# Altium schematic sheet encoder.SchDoc
size A3
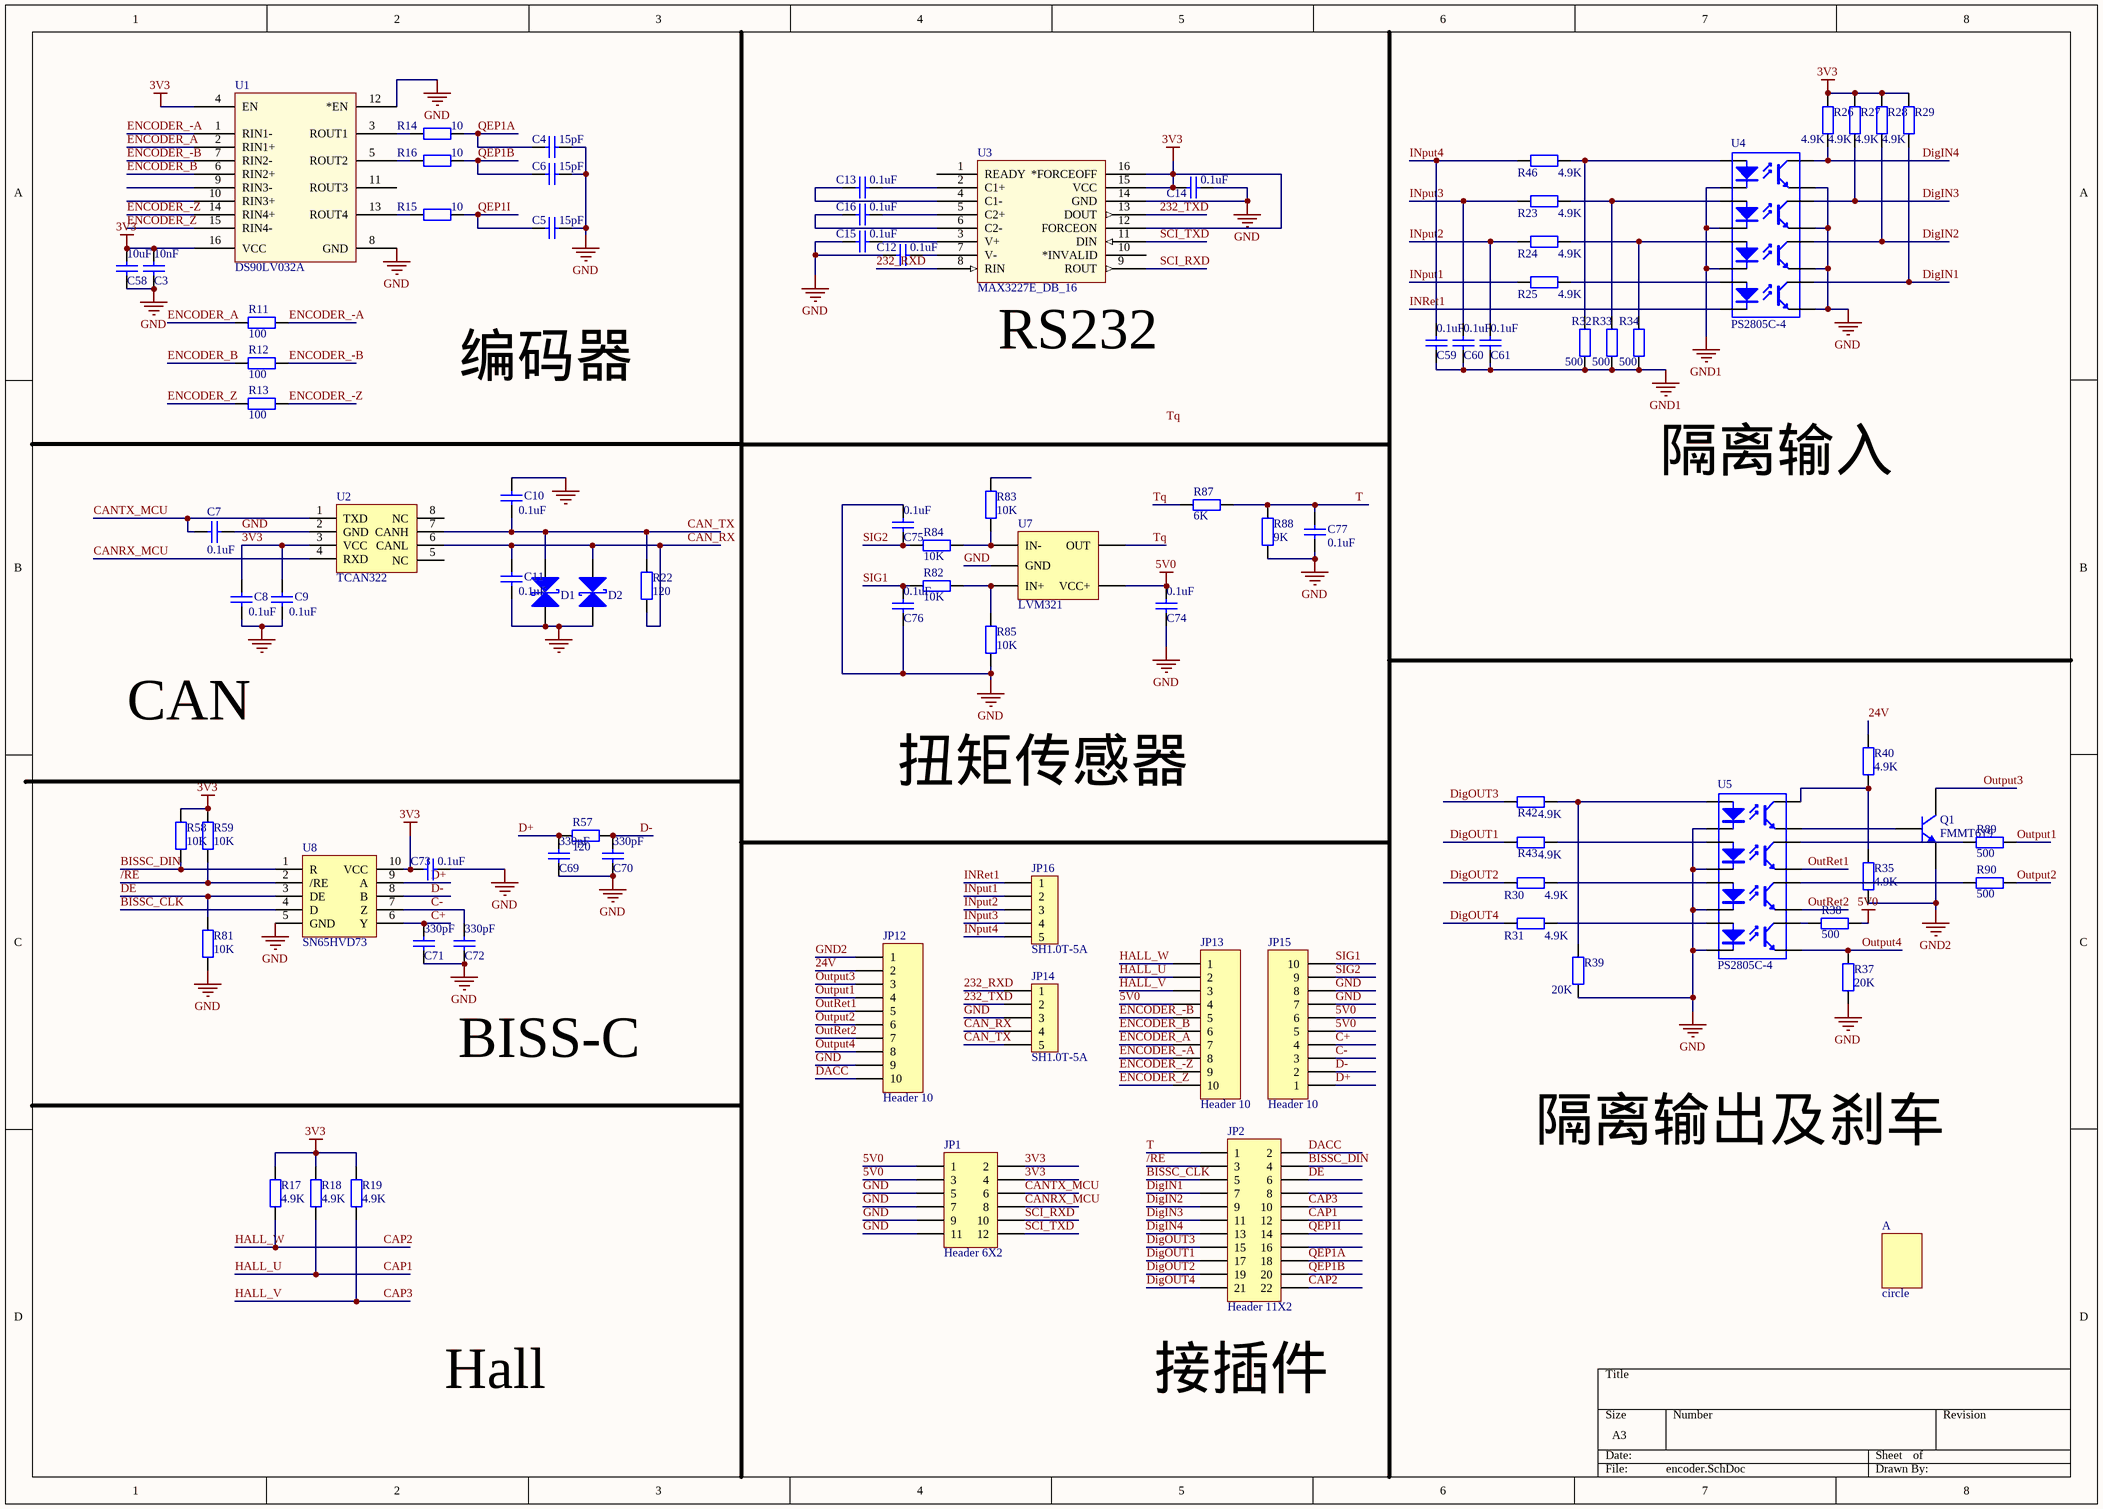
[diagram p0: encoder.SchDoc]

## Parts
A  circle  [Circle]
C3  value 10nF  [CC1608-0603]  (hidden comment: 0603B103J6R3NT)
C4  value 15pF  [CC1608-0603]  (hidden comment: 0603B150J6R3NT)
C5  value 15pF  [CC1608-0603]  (hidden comment: 0603B150J6R3NT)
C6  value 15pF  [CC1608-0603]  (hidden comment: 0603B150J6R3NT)
C7  value 0.1uF  [CC1608-0603]  (hidden comment: 0603B104J6R3NT)
C8  value 0.1uF  [CC1608-0603]  (hidden comment: 0603B104J6R3NT)
C9  value 0.1uF  [CC1608-0603]  (hidden comment: 0603B104J6R3NT)
C10  value 0.1uF  [CC1608-0603]  (hidden comment: 0603B104J6R3NT)
C11  value 0.1uF  [CC1608-0603]  (hidden comment: 0603B104J6R3NT)
C12  value 0.1uF  [CC1608-0603]  (hidden comment: 0603B104J6R3NT)
C13  value 0.1uF  [CC1608-0603]  (hidden comment: 0603B104J6R3NT)
C14  value 0.1uF  [CC1608-0603]  (hidden comment: 0603B104J6R3NT)
C15  value 0.1uF  [CC1608-0603]  (hidden comment: 0603B104J6R3NT)
C16  value 0.1uF  [CC1608-0603]  (hidden comment: 0603B104J6R3NT)
C58  value 10uF  [CC2012-0805]  (hidden comment: 0805B106J100NT)
C59  value 0.1uF  [CC1608-0603]  (hidden comment: 0603B104J6R3NT)
C60  value 0.1uF  [CC1608-0603]  (hidden comment: 0603B104J6R3NT)
C61  value 0.1uF  [CC1608-0603]  (hidden comment: 0603B104J6R3NT)
C69  value 330pF  [CC1608-0603]  (hidden comment: 0603B331J6R3NT)
C70  value 330pF  [CC1608-0603]  (hidden comment: 0603B331J6R3NT)
C71  value 330pF  [CC1608-0603]  (hidden comment: 0603B331J6R3NT)
C72  value 330pF  [CC1608-0603]  (hidden comment: 0603B331J6R3NT)
C73  value 0.1uF  [CC1608-0603]  (hidden comment: 0603B104J6R3NT)
C74  value 0.1uF  [CC1608-0603]  (hidden comment: 0603B104J6R3NT)
C75  value 0.1uF  [CC1608-0603]  (hidden comment: 0603B104J6R3NT)
C76  value 0.1uF  [CC1608-0603]  (hidden comment: 0603B104J6R3NT)
C77  value 0.1uF  [CC1608-0603]  (hidden comment: 0603B104J6R3NT)
D1  Diode Schottky  [TVS]  (value not drawn)
D2  Diode Schottky  [TVS]  (value not drawn)
JP1  Header 6X2  [DC_1.27_12]
JP2  Header 11X2  [DC_1.27_22]
JP12  Header 10  [SH1.0T-10A]
JP13  Header 10  [SH1.0T-10A]
JP14  SH1.0T-5A  [SH1.0T-5A]
JP15  Header 10  [SH1.0T-10A]
JP16  SH1.0T-5A  [SH1.0T-5A]
Q1  FMMT619  [SOT-23]
R11  value 100  [CR1608-0603]  (hidden comment: RC03K101JT)
R12  value 100  [CR1608-0603]  (hidden comment: RC03K101JT)
R13  value 100  [CR1608-0603]  (hidden comment: RC03K101JT)
R14  value 10  [CR1608-0603]  (hidden comment: RC03K100JT)
R15  value 10  [CR1608-0603]  (hidden comment: RC03K100JT)
R16  value 10  [CR1608-0603]  (hidden comment: RC03K100JT)
R17  value 4.9K  [CR1608-0603]  (hidden comment: RC03K492JT)
R18  value 4.9K  [CR1608-0603]  (hidden comment: RC03K492JT)
R19  value 4.9K  [CR1608-0603]  (hidden comment: RC03K492JT)
R22  value 120  [CR1608-0603]  (hidden comment: RC03K121JT)
R23  value 4.9K  [CR1608-0603]  (hidden comment: RC03K492JT)
R24  value 4.9K  [CR1608-0603]  (hidden comment: RC03K492JT)
R25  value 4.9K  [CR1608-0603]  (hidden comment: RC03K492JT)
R26  value 4.9K  [CR1608-0603]  (hidden comment: RC03K492JT)
R27  value 4.9K  [CR1608-0603]  (hidden comment: RC03K492JT)
R28  value 4.9K  [CR1608-0603]  (hidden comment: RC03K492JT)
R29  value 4.9K  [CR1608-0603]  (hidden comment: RC03K492JT)
R30  value 4.9K  [CR1608-0603]  (hidden comment: RC03K492JT)
R31  value 4.9K  [CR1608-0603]  (hidden comment: RC03K492JT)
R32  value 500  [CR1608-0603]  (hidden comment: RC03K501JT)
R33  value 500  [CR1608-0603]  (hidden comment: RC03K501JT)
R34  value 500  [CR1608-0603]  (hidden comment: RC03K501JT)
R35  value 4.9K  [CR1608-0603]  (hidden comment: RC03K492JT)
R37  value 20K  [CR1608-0603]  (hidden comment: RC03K203JT)
R38  value 500  [CR1608-0603]  (hidden comment: RC03K501JT)
R39  value 20K  [CR1608-0603]  (hidden comment: RC03K203JT)
R40  value 4.9K  [CR1608-0603]  (hidden comment: RC03K492JT)
R42  value 4.9K  [CR1608-0603]  (hidden comment: RC03K492JT)
R43  value 4.9K  [CR1608-0603]  (hidden comment: RC03K492JT)
R46  value 4.9K  [CR1608-0603]  (hidden comment: RC03K492JT)
R57  value 120  [CR1608-0603]  (hidden comment: RC03K121JT)
R58  value 10K  [CR1608-0603]  (hidden comment: RC03K103JT)
R59  value 10K  [CR1608-0603]  (hidden comment: RC03K103JT)
R81  value 10K  [CR1608-0603]  (hidden comment: RC03K103JT)
R82  value 10K  [CR1608-0603]  (hidden comment: RC03K103JT)
R83  value 10K  [CR1608-0603]  (hidden comment: RC03K103JT)
R84  value 10K  [CR1608-0603]  (hidden comment: RC03K103JT)
R85  value 10K  [CR1608-0603]  (hidden comment: RC03K103JT)
R87  value 6K  [CR1608-0603]  (hidden comment: RC03K602JT)
R88  value 9K  [CR1608-0603]  (hidden comment: RC03K902JT)
R89  value 500  [CR1608-0603]  (hidden comment: RC03K501JT)
R90  value 500  [CR1608-0603]  (hidden comment: RC03K501JT)
U1  DS90LV032A  [DS90LV032A]
U2  TCAN322  [TCAN332]
U3  MAX3227E_DB_16  [MAX3227E]
U4  PS2805C-4  [PS2805C_4]
U5  PS2805C-4  [PS2805C_4]
U7  LVM321  [LVM321]
U8  SN65HVD73  [SN65HVD73]

## Nets
3V3: C3.2 C8.2 C9.2 C14.2 C58.2 C73.1 JP1.2 JP1.4 R17.1 R18.1 R19.1 R26.2 R27.2 R28.2 R29.2 R58.1 R59.1 U1.4(EN) U1.16(VCC) U2.3(VCC) U3.12(FORCEON) U3.15(VCC) U3.16(*FORCEOFF) U8.10(VCC)
5V0: C74.2 JP1.1 JP1.3 JP13.4 JP15.5 JP15.6 R38.1 U7.5(VCC+)
GND: C3.1 C4.2 C5.1 C6.1 C7.1 C8.1 C9.1 C10.2 C11.1 C12.2 C14.1 C15.1 C58.1 C69.1 C70.1 C71.1 C72.1 C73.2 C74.1 C75.2 C76.1 C77.2 D1.1(A) D2.1(A) JP1.5 JP1.7 JP1.9 JP1.11 JP12.9 JP14.3 JP15.7 JP15.8 R37.1 R39.1 R81.2 R85.1 R88.2 U1.8(GND) U1.12(*EN) U2.2(GND) U3.14(GND) U4.9(A) U4.11(A) U4.13(A) U4.15(E) U5.2(K) U5.4(A) U5.6(A) U5.8(A) U7.2(GND) U8.5(GND)
GND1: C59.1 C60.1 C61.1 R32.2 R33.2 R34.2 U4.2(K) U4.4(A) U4.6(A)
GND2: JP12.1 Q1.2(E) R35.1
24V: JP12.2 R40.2
232_RXD: JP14.1 U3.8(RIN)
232_TXD: JP14.2 U3.13(DOUT)
/RE: JP2.3 R59.2 U8.2(/RE)
BISSC_CLK: JP2.5 U8.4(D)
BISSC_DIN: JP2.4 R58.2 U8.1(R)
C+: C71.2 JP15.4 U8.6(Y)
C-: C72.2 JP15.3 U8.7(Z)
CAN_RX: C11.2 D2.2(K) JP14.4 R22.1 U2.6(CANL)
CAN_TX: C10.1 D1.2(K) JP14.5 R22.2 U2.7(CANH)
CANRX_MCU: JP1.8 U2.4(RXD)
CANTX_MCU: C7.2 JP1.6 U2.1(TXD)
CAP1: JP2.12 JP13.2 R18.2  [also labelled HALL_U]
CAP2: JP2.22 JP13.1 R17.2  [also labelled HALL_W]
CAP3: JP2.10 JP13.3 R19.2  [also labelled HALL_V]
D+: C69.2 JP15.1 R57.2 U8.9(A)
D-: C70.2 JP15.2 R57.1 U8.8(B)
DACC: JP2.2 JP12.10
DE: JP2.6 R81.1 U8.3(DE)
DigIN1: JP2.7 R29.1 U4.10(A)
DigIN2: JP2.9 R28.1 U4.12(A)
DigIN3: JP2.11 R27.1 U4.14(A)
DigIN4: JP2.13 R26.1 U4.16(C)
DigOUT1: JP2.17 R43.2
DigOUT2: JP2.19 R30.2
DigOUT3: JP2.15 R42.2
DigOUT4: JP2.21 R31.2
ENCODER_-A: JP13.8 R11.1 U1.1(RIN1-)
ENCODER_-B: JP13.5 R12.1 U1.7(RIN2-)
ENCODER_-Z: JP13.9 R13.1 U1.14(RIN4+)
ENCODER_A: JP13.7 R11.2 U1.2(RIN1+)
ENCODER_B: JP13.6 R12.2 U1.6(RIN2+)
ENCODER_Z: JP13.10 R13.2 U1.15(RIN4-)
INput1: JP16.2 R25.2
INput2: C61.2 JP16.3 R24.2
INput3: C60.2 JP16.4 R23.2
INput4: C59.2 JP16.5 R46.2
INRet1: JP16.1 U4.8(A)
Output1: JP12.4 R89.1
Output2: JP12.6 R90.1
Output3: JP12.3 Q1.3(C)
Output4: JP12.8 R37.2 U5.9(A)
OutRet1: JP12.5 U5.13(A)
OutRet2: JP12.7 U5.11(A)
QEP1A: C4.1 JP2.18 R14.1
QEP1B: C6.2 JP2.20 R16.1
QEP1I: C5.2 JP2.14 R15.1
SCI_RXD: JP1.10 U3.9(ROUT)
SCI_TXD: JP1.12 U3.11(DIN)
SIG1: C76.2 JP15.10 R82.1
SIG2: C75.1 JP15.9 R84.1
T: C77.1 JP2.1 R87.1 R88.1
Tq: R87.2 U7.4(OUT)
NetC12_1: C12.1 U3.7(V-)
NetC13_1: C13.1 U3.2(C1+)
NetC13_2: C13.2 U3.4(C1-)
NetC15_2: C15.2 U3.3(V+)
NetC16_1: C16.1 U3.5(C2+)
NetC16_2: C16.2 U3.6(C2-)
NetQ1_1: Q1.1(B) U5.15(E)
NetR14_2: R14.2 U1.3(ROUT1)
NetR15_2: R15.2 U1.13(ROUT4)
NetR16_2: R16.2 U1.5(ROUT2)
NetR23_1: R23.1 R33.1 U4.3(A)
NetR24_1: R24.1 R34.1 U4.5(A)
NetR25_1: R25.1 U4.7(A)
NetR30_1: R30.1 U5.5(A)
NetR31_1: R31.1 U5.7(A)
NetR32_1: R32.1 R46.1 U4.1(A)
NetR35_2: R35.2 R40.1 U5.16(C)
NetR38_2: R38.2 U5.10(A)
NetR39_2: R39.2 R42.1 U5.1(A)
NetR43_1: R43.1 U5.3(A)
NetR82_2: R82.2 R85.2 U7.1(IN+)
NetR83_1: R83.1 R84.2 U7.3(IN-)
NetR89_2: R89.2 U5.14(A)
NetR90_2: R90.2 U5.12(A)

Not connected (* = marked no-connect by the designer): JP2 8 16; R83 2; U1 9(RIN3-) 10(RIN3+) 11(ROUT3); U2 5(NC) 8(NC); U3 1(READY) 10(*INVALID)

## Notes on the sheet
- (near U3) RS232
- 编码器
- 隔离输入
- CAN
- 扭矩传感器
- BISS-C
- 隔离输出及刹车
- Hall
- (near JP2) 接插件
- Labels drawn without touching a wire or pin: Tq

## Library data of the parts
C3-C16 C58-C61 C69-C77 = CAP
D1 D2 = Diode Schottky: Schottky Diode; Published: 8-Jun-2000; LatestRevisionDate: 17-Jul-2002; LatestRevisionNote: Re-released for DXP Platform.; PackageReference: SMB; Publisher: Altium Limited; Code_JEDEC: DO-214-AA
JP1 = Header 6X2: Header, 6-Pin, Dual row; LatestRevisionDate: 17-Jul-2002; LatestRevisionNote: Re-released for DXP Platform.; Publisher: Altium Limited
JP2 = Header 11X2: Header, 10-Pin, Dual row; LatestRevisionDate: *; LatestRevisionNote: *; Publisher: *
JP12 JP13 JP15 = Header 10: Header, 10-Pin; LatestRevisionDate: 17-Jul-2002; LatestRevisionNote: Re-released for DXP Platform.; Publisher: Altium Limited
Q1 = NPN: NPN Bipolar Transistor; Published: *; Revision: *; Publisher: *; Code - JEDEC: *
R11-R19 R22-R35 R37-R40 R42 R43 R46 R57-R59 R81-R85 R87-R90 = Resistor
U3 = MAX3227E_DB_16: Imported; Manufacturer: Texas Instruments; INDUSTRY_STD_PKG_TYPE: SSOP; FAMILY_NAME: RS-232; PIN_COUNT: 16; PACKAGE_DESIGNATOR: DB; Datasheet URL: http://www.ti.com/lit/gpn/MAX3227E; GENERIC_PART_NUMBER: MAX3227E; Vendor: Texas Instruments; Manufacturer_Part_Number: max3227e_db_16; RefDes: RefDes; Type: DEV; Value: Value
U4 U5 = PS2805C-4: Optoisolator; Published: *; Revision: *; Publisher: *